# Altium schematic sheet FTDI.SchDoc
size A
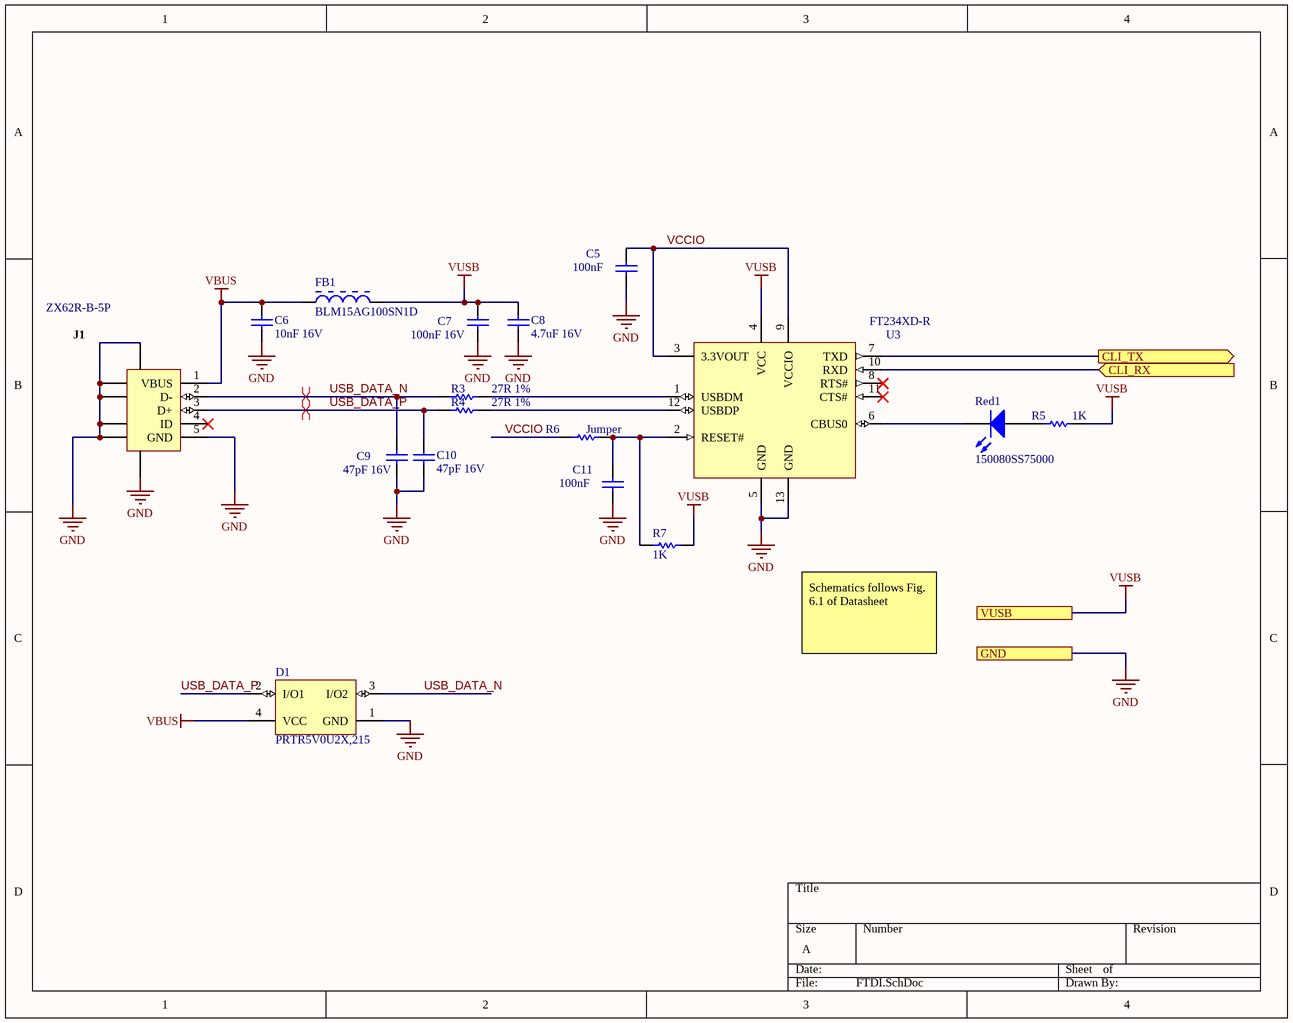
[diagram p0: FTDI.SchDoc]

## Parts
C5  100nF  [CAPC0402(1005)60_N]
C6  10nF 16V  [CAPC0603(1608)100_L]
C7  100nF 16V  [CAPC0603(1608)100_N]
C8  4.7uF 16V  [CAPC0805(2012)145_N]
C9  47pF 16V  [CAPC0603(1608)100_L]
C10  47pF 16V  [CAPC0603(1608)100_L]
C11  100nF  [CAPC0402(1005)60_N]
D1  PRTR5V0U2X,215  [NXP-SOT143B-4_V]
FB1  BLM15AG100SN1D  [MURA-BLM15-CHIP-2_V]
J1  ZX62R-B-5P  [HIRO-ZX62R-B-5P_V]
R3  27R 1%  [RESC0603(1608)_N]
R4  27R 1%  [RESC0603(1608)_N]
R5  1K  [RESC0603(1608)_M]
R6  Jumper  [RESC0603(1608)_N]
R7  1K  [RESC0603(1608)_M]
Red1  150080SS75000  [0805_A]
U3  FT234XD-R  [DFN-12_V]

## Ports
CLI_RX (in), CLI_TX (out), GND, VUSB

## Nets
GND: C5.1 C6.1 C7.1 C8.1 C9.1 C10.1 C11.1 D1.1(GND) J1.5(GND) J1.6(SHLD) J1.7(SHLD) J1.8(SHLD) J1.9(SHLD) J1.10(SHLD) J1.11(SHLD) U3.5(GND) U3.13(GND) ; port GND
VBUS: C6.2 D1.4(VCC) FB1.1 J1.1(VBUS)
VUSB: C7.2 C8.2 FB1.2 R5.2 R7.1 U3.4(VCC) ; port VUSB
CLI_RX: U3.10(RXD) ; port CLI_RX
CLI_TX: U3.7(TXD) ; port CLI_TX
USB_DATA_N: C9.2 D1.3(I/O2) J1.2(D-) R3.1
USB_DATA_P: C10.2 D1.2(I/O1) J1.3(D+) R4.1
VCCIO: C5.2 R6.1 U3.3(3.3VOUT) U3.9(VCCIO)
NetC11_2: C11.2 R6.2 R7.2 U3.2(RESET#)
NetR3_2: R3.2 U3.1(USBDM)
NetR4_2: R4.2 U3.12(USBDP)
NetR5_1: R5.1 Red1.2(A)
NetRed1_1: Red1.1(K) U3.6(CBUS0)

Not connected (* = marked no-connect by the designer): J1 4(ID)*; U3 8(RTS#)* 11(CTS#)*

## Layout directives
differential pair: USB_DATA_N, USB_DATA_P

## Notes on the sheet
- Schematics follows Fig. 6.1 of Datasheet

## Library data of the parts
C5 C11 = CMP-1034-02062-1: CAP 100nF 6.3V ±20% 0402 (1005 Metric) Thickness 0.6mm SMD; Case-EIA: 0402; Tolerance: Â±20%; Case-Metric: 1005; Value: 100nF; Technology: SMT; Max Thickness: 0.6 mm; Rated Voltage: 6.3 V
C6 = CMP-1035-02311-1: CAP 10nF 16V ±10% 0603 (1608 Metric) Thickness 1mm SMD; Case-EIA: 0603; Case-Metric: 1608; Tolerance: Â±10%; Rated Voltage: 16 V; Value: 10nF; Max Thickness: 1 mm; Technology: SMT
C7 = CMP-1035-02584-1: CAP 100nF 16V ±10% 0603 (1608 Metric) Thickness 1mm SMD; Tolerance: Â±10%; Case-EIA: 0603; Case-Metric: 1608; Technology: SMT; Max Thickness: 1 mm; Value: 100nF; Rated Voltage: 16 V
C8 = CMP-1036-04889-1: CAP 4.7uF 16V ±10% 0805 (2012 Metric) Thickness 1.45mm SMD; Case-EIA: 0805; Case-Metric: 2012; Tolerance: Â±10%; Technology: SMT; Value: 4.7uF; Rated Voltage: 16 V; Max Thickness: 1.45 mm
C9 C10 = CMP-1035-01048-1: CAP 47pF 16V ±0.5pF 0603 (1608 Metric) Thickness 1mm SMD; Case-EIA: 0603; Case-Metric: 1608; Tolerance: Â±0.5pF; Technology: SMT; Value: 47pF; Rated Voltage: 16 V; Max Thickness: 1 mm
D1 = CMP-2000-05285-1: Ultra Low Capacitance Double Rail-to-Rail ESD Protection Diode, 5.5 V, 1 pF, -40 to 85 degC, 4-Pin SOT143B, RoHS, Tape and Reel; Manufacturer: NXP Semiconductors; Capacitance Value: 16pF; Number of Elements: 1; Rad Hardened: No; Reverse Breakdown Voltage: 6V; Working Voltage (Max): 5.5V; Polarity: Uni-Directional; Configuration: Quad; Leakage Current: 0.1uA; Product Height (mm): 1mm; Suppressor Type: DiodeArrays; Product Length (mm): 3mm; Product Depth (mm): 1.4mm; ESD Protection Voltage: 8KV@ContactDisc; Package Type: SOT; Mounting: SurfaceMount; Packaging: TapeandReel; Datasheet Version: Rev. 02, 01/2008; Reverse Stand-off Voltage: 5.5V; Manufacturer URL: http://www.nxp.com/; Operating Temp Range: -40Cto85C; Operating Temperature Classification: Industrial; Working Voltage: 5.5V; Operating Temperature Min Deg. C: -40C; Datasheet URL: https://datasheet.ciiva.com/4479/prtr5v0u2x-102853-4479461.pdf; Leakage Current (Max): 0.1uA; Direction Type: Uni-Directional; Pin Count: 3+Tab; Operating Temperature Max Deg. C: 85C; Mounting Style: SurfaceMount; Package / Case: SOT
FB1 = CMP-0686-00176-3: Chip Ferrite Bead for General Use, 10 Ohm, 1000 mA, -55 to 125 degC, 1 x 0.5 x 0.55 mm SMD, Tape and Reel; Manufacturer: Murata; Impedance (at 100 MHz): 10 Ohm Typ.; Rated Current: 1000 mA; DC Resistance: 0.025 Ohm Max.; PackageDescription: 2-Pin Chip, Body 1 x 0.5 mm; DatasheetVersion: 08/2013; Mounting Technology: Surface Mount; ComponentLink2URL: http://www.murata.com/products/catalog/pdf/c31e.pdf; Packing: Tape and Reel; ComponentLink1URL: http://www.murata.com/; PartNumber: BLM15AG100SN1D; ComponentLink1Description: Manufacturer URL; Operating Temperature Range: -55 to 125 degC; ComponentLink2Description: Datasheet; ComponentLink3Description: Package Specification; PackageReference: BLM15-2; ComponentLink3URL: http://www.murata.com/products/catalog/pdf/c31e.pdf
J1 = CMP-0031-00001-1: Connector; USBMicro-B,Reverse type, SMT; 5 Position; Right Angle; DatasheetVersion: 08/2010; Operating Temperature: -30 to 85 degC; Mounting Technology: Surface Mount; PartNumber: ZX62R-B-5P; PackageReference: ZX62R-B-5P; ComponentLink2URL: http://www.hirose.co.jp/cataloge_hp/e24200011.pdf; ComponentLink1URL: http://www.hirose.com/â€Ž; ComponentLink2Description: Datasheet; PackageDescription: 5-Pin USB Micro-B R/A Connector; ComponentLink1Description: Manufacturer URL
R3 R4 = CMP-1012-00331-1: 27R 0.1W 1% 0603 (1608 Metric)  SMD; Case-EIA: 0603; Value: 27.00 Ohm; Case-Metric: 1608; Technology: SMT; Tolerance: 1 %; Power: 0.1 W
R5 R7 = CMP-1012-00510-1: 1K 0.1W 1% 0603 (1608 Metric)  SMD; Case-Metric: 1608; Case-EIA: 0603; Value: 1000.00 Ohm; Technology: SMT; Tolerance: 1 %; Power: 0.1 W
R6 = CMP-1012-00001-1: Jumper 0603 (1608 Metric); Case-Metric: 1608; Value: 0.00 Ohm; Power: None; Case-EIA: 0603; Technology: SMT; Tolerance: None
Red1 = CMP-1426-00010-1: SMD mono-color Chip LED, WL-SMCW, Super Red; Manufacturer: Wuerth Elektronik; PackageReference: 0805_A; ComponentLink2URL: http://katalog.we-online.com/led/datasheet/150080SS75000.pdf; ComponentLink1URL: http://www.we-online.com; Color: Super Red; ComponentLink2Description: Datasheet; ComponentLink1Description: Manufacturer URL; PartNumber: 150080SS75000
U3 = CMP-0248-00027-1: FT234XD USB to BASIC UART IC, -40 to +85 degC, 12-Pin DFN, Pb-Free, Tape and Reel; Manufacturer: FTDI; PackageReference: DFN-12; PackageVersion: Feb-13; DatasheetVersion: ver 1.1, Feb-2013; ComponentLink1URL: http://www.ftdichip.com/; PartNumber: FT234XD-R; ComponentLink2URL: http://www.ftdichip.com/Support/Documents/DataSheets/ICs/DS_FT234XD.pdf; ComponentLink1Description: Manufacturer URL; PackageDescription: 12-Pin Dual Flat No-Lead, 3 x 3 mm Body, 0.45 mm Pitch, Exposed Pad; ComponentLink2Description: Datasheet